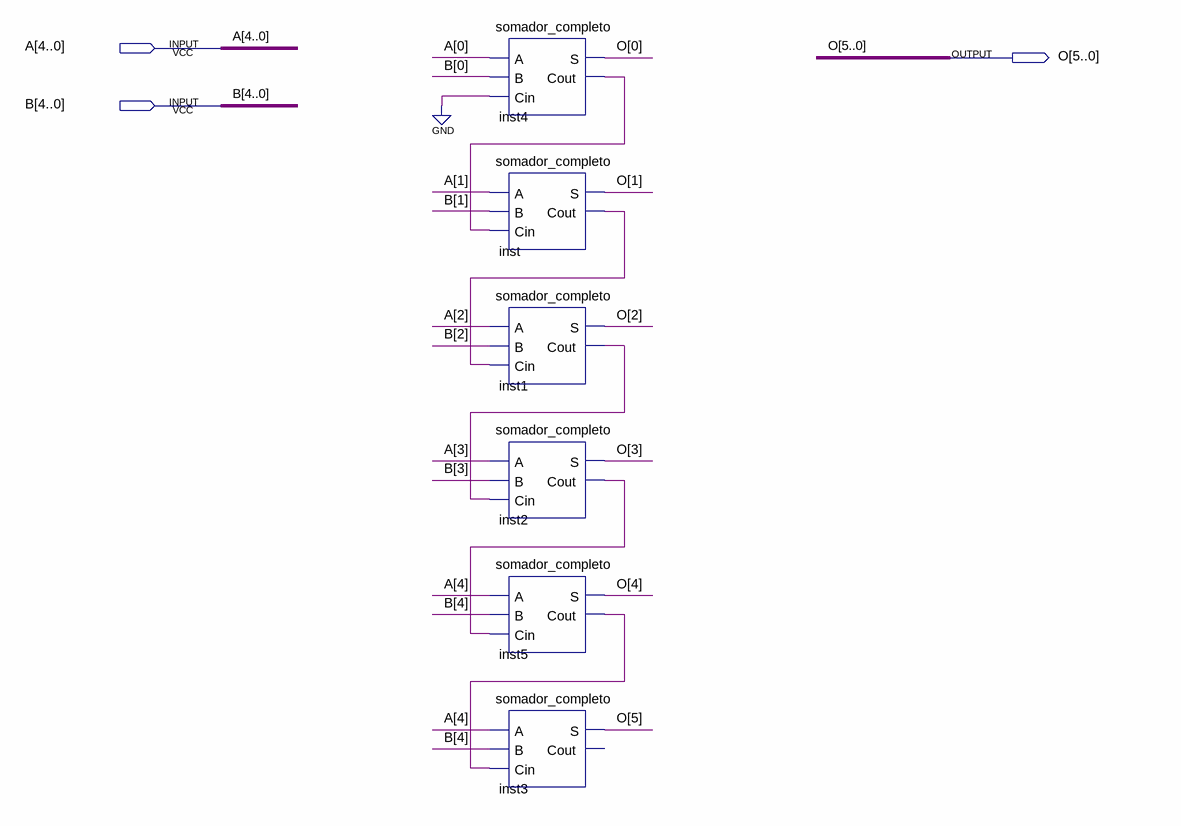
[diagram p0: schematic sheet]
// Quartus schematic somador6.bdf as structural Verilog: 6 symbols, 3 pins
module somador6 (
  input  [4:0] A,
  input  [4:0] B,
  output [5:0] O
);

  wire inst1_cout, inst2_cout, inst4_cout, inst5_cout, inst_cout;

  somador_completo inst4 (.A(A[0]), .B(B[0]), .Cin(1'b0), .S(O[0]), .Cout(inst4_cout));
  somador_completo inst (.A(A[1]), .B(B[1]), .Cin(inst4_cout), .S(O[1]), .Cout(inst_cout));
  somador_completo inst1 (.A(A[2]), .B(B[2]), .Cin(inst_cout), .S(O[2]), .Cout(inst1_cout));
  somador_completo inst2 (.A(A[3]), .B(B[3]), .Cin(inst1_cout), .S(O[3]), .Cout(inst2_cout));
  somador_completo inst5 (.A(A[4]), .B(B[4]), .Cin(inst2_cout), .S(O[4]), .Cout(inst5_cout));
  somador_completo inst3 (.A(A[4]), .B(B[4]), .Cin(inst5_cout), .S(O[5]));  // open: Cout
endmodule
